# Altium schematic sheet 小车主板原理图.SchDoc
size A3
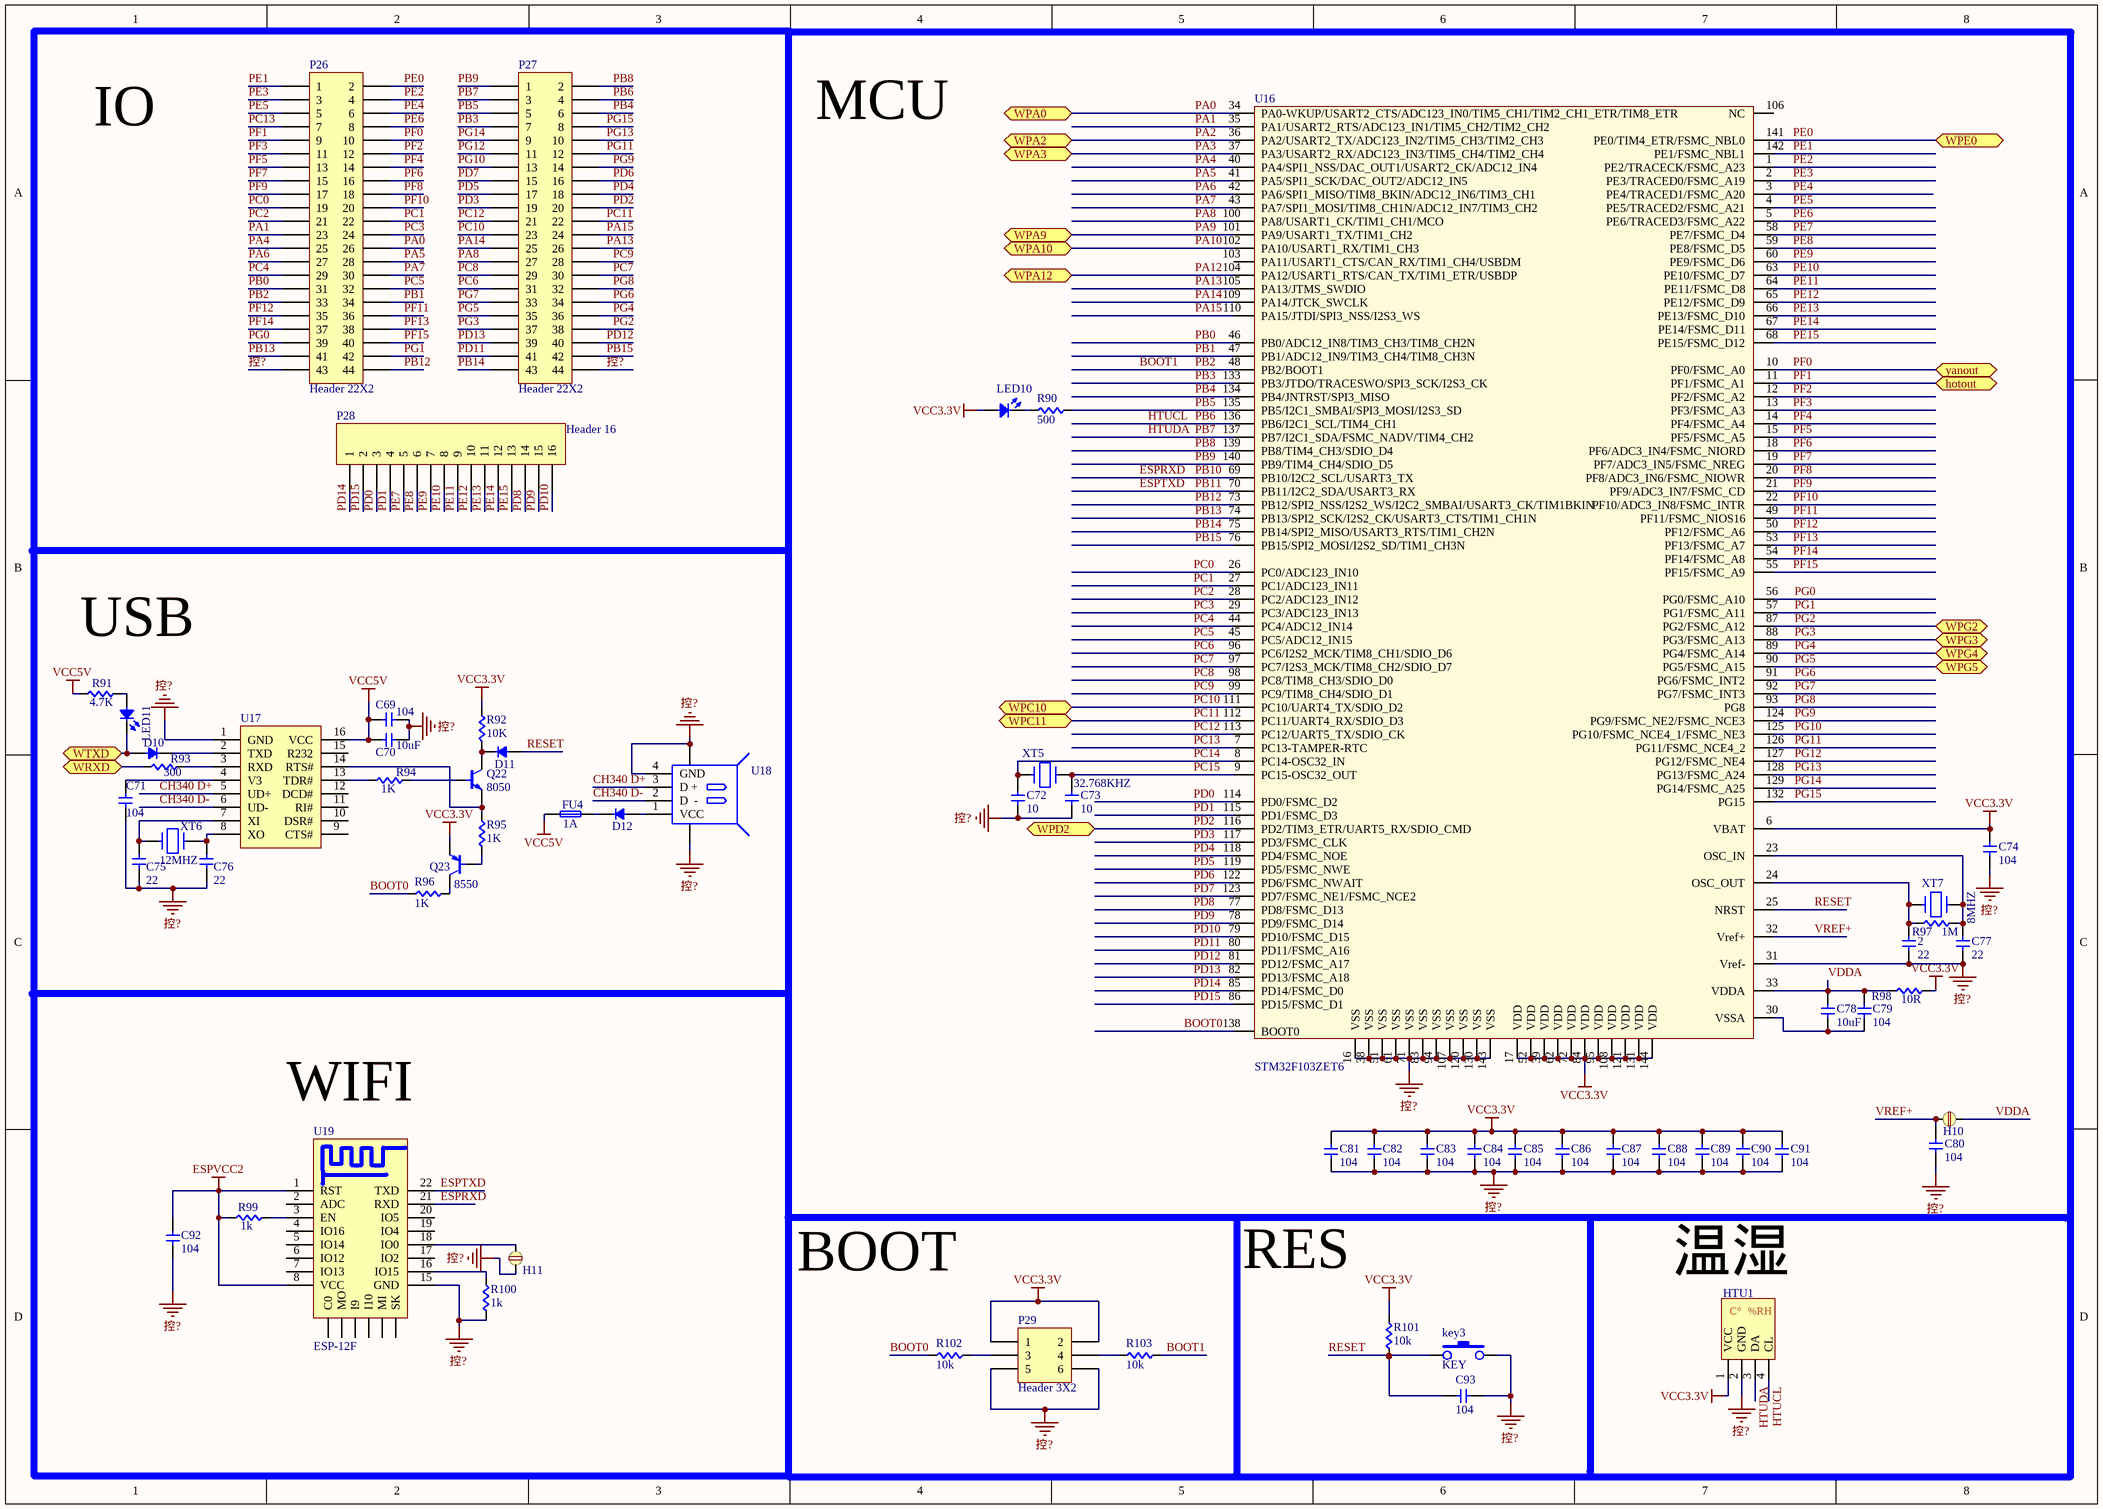
[diagram p0: 小车主板原理图.SchDoc]

## Parts
2  22  [0805C]
C69  104  [0805C]
C70  10uF  [0805C]
C71  104  [0805C]
C72  10  [0805C]
C73  10  [0805C]
C74  104  [0805C]
C75  22  [0805C]
C76  22  [0805C]
C77  22  [0805C]
C78  10uF  [0805C]
C79  104  [0805C]
C80  104  [0805C]
C81  104  [0805C]
C82  104  [0805C]
C83  104  [0805C]
C84  104  [0805C]
C85  104  [0805C]
C86  104  [0805C]
C87  104  [0805C]
C88  104  [0805C]
C89  104  [0805C]
C90  104  [0805C]
C91  104  [0805C]
C92  104  [0805C]
C93  104  [0805C]
D10  D  [1206D]  (value not drawn)
D11  D  [1206D]  (value not drawn)
D12  D  [DO-214-M7-  4007贴片]  (value not drawn)
FU4  1A  [1206]
H10  2脚  [2P]  (value not drawn)
H11  2脚  [2P]  (value not drawn)
HTU1  HTU21D  [HDR1X4H]  (value not drawn)
key3  KEY  [AN12]
LED10  LED  [0805D]  (value not drawn)
LED11  LED  [0805D]  (value not drawn)
P26  Header 22X2  [HDR2X22]
P27  Header 22X2  [HDR2X22]
P28  Header 16  [HDR1X16]
P29  Header 3X2  [HDR2X3]
Q22  8050  [SOT-23]
Q23  8550  [SOT-23]
R90  500  [0805]
R91  4.7K  [0805]
R92  10K  [0805]
R93  300  [0805]
R94  1K  [0805]
R95  1K  [0805]
R96  1K  [0805]
R97  1M  [0805]
R98  10R  [0805]
R99  1k  [0805]
R100  1k  [0805]
R101  10k  [0805]
R102  10k  [0805]
R103  10k  [0805]
U16  STM32F103ZET6  [TQFP144]
U17  CH340G  [SOP-16]  (value not drawn)
U18  USB A  [USB A 公]  (value not drawn)
U19  ESP-12F  [ESP-12F]
XT5  32.768KHZ  [XTAL-T]
XT6  12MHZ  [XTAL-T]
XT7  8MHZ  [XTAL-T]

## Ports
hotout, WPA0, WPA2, WPA3, WPA9, WPA10, WPA12, WPC10, WPC11, WPD2, WPE0, WPG2, WPG3, WPG4, WPG5, WRXD, WTXD, yanout

## Nets
ESPVCC2: C92.2 R99.1 U19.1(RST) U19.8(VCC)
VCC3.3V: C74.1 C81.2 C82.2 C83.2 C84.2 C85.2 C86.2 C87.2 C88.2 C89.2 C90.2 C91.2 HTU1.1(VCC) LED10.1(A) P29.1 P29.2 Q23.2(e) R92.2 R98.2 R101.2 U16.6(VBAT) U16.17(VDD) U16.39(VDD) U16.52(VDD) U16.62(VDD) U16.72(VDD) U16.84(VDD) U16.95(VDD) U16.108(VDD) U16.121(VDD) U16.131(VDD) U16.144(VDD)
VCC5V: C69.1 C70.1 FU4.1 R91.2 U17.16(VCC)
控?: 2.1 C69.2 C70.2 C71.2 C72.1 C73.1 C74.2 C75.1 C76.1 C77.1 C80.1 C81.1 C82.1 C83.1 C84.1 C85.1 C86.1 C87.1 C88.1 C89.1 C90.1 C91.1 C92.1 C93.2 H11.1 HTU1.2(GND) key3.2 P26.43 P27.44 P29.5 P29.6 R100.1 U16.16(VSS) U16.31(Vref-) U16.38(VSS) U16.51(VSS) U16.61(VSS) U16.71(VSS) U16.83(VSS) U16.94(VSS) U16.107(VSS) U16.120(VSS) U16.130(VSS) U16.143(VSS) U17.1(GND) U18.4(GND) U18.5 U18.6 U19.15(GND)
BOOT0: R96.1 R102.2 U16.138(BOOT0)
BOOT1: P26.33 R103.1 U16.48(PB2/BOOT1)  [also labelled PB2]
CH340 D+: U17.5(UD+) U18.3(D_+)
CH340 D-: U17.6(UD-) U18.2(D__-)
ESPRXD: U16.69(PB10/I2C2_SCL/USART3_TX) U19.21(RXD)  [also labelled PB10]
ESPTXD: U16.70(PB11/I2C2_SDA/USART3_RX) U19.22(TXD)  [also labelled PB11]
HTUCL: HTU1.4(CL) P27.4 U16.136(PB6/I2C1_SCL/TIM4_CH1)  [also labelled PB6]
HTUDA: HTU1.3(DA) P27.3 U16.137(PB7/I2C1_SDA/FSMC_NADV/TIM4_CH2)  [also labelled PB7]
PA0: P26.26 U16.34(PA0-WKUP/USART2_CTS/ADC123_IN0/TIM5_CH1/TIM2_CH1_ETR/TIM8_ETR) ; port WPA0
PA1: P26.23 U16.35(PA1/USART2_RTS/ADC123_IN1/TIM5_CH2/TIM2_CH2)
PA2: U16.36(PA2/USART2_TX/ADC123_IN2/TIM5_CH3/TIM2_CH3) ; port WPA2
PA3: U16.37(PA3/USART2_RX/ADC123_IN3/TIM5_CH4/TIM2_CH4) ; port WPA3
PA4: P26.25 U16.40(PA4/SPI1_NSS/DAC_OUT1/USART2_CK/ADC12_IN4)
PA5: P26.28 U16.41(PA5/SPI1_SCK/DAC_OUT2/ADC12_IN5)
PA6: P26.27 U16.42(PA6/SPI1_MISO/TIM8_BKIN/ADC12_IN6/TIM3_CH1)
PA7: P26.30 U16.43(PA7/SPI1_MOSI/TIM8_CH1N/ADC12_IN7/TIM3_CH2)
PA8: P27.27 U16.100(PA8/USART1_CK/TIM1_CH1/MCO)
PA9: U16.101(PA9/USART1_TX/TIM1_CH2) ; port WPA9
PA10: U16.102(PA10/USART1_RX/TIM1_CH3) ; port WPA10
PA12: U16.104(PA12/USART1_RTS/CAN_TX/TIM1_ETR/USBDP) ; port WPA12
PA13: P27.26 U16.105(PA13/JTMS_SWDIO)
PA14: P27.25 U16.109(PA14/JTCK_SWCLK)
PA15: P27.24 U16.110(PA15/JTDI/SPI3_NSS/I2S3_WS)
PB0: P26.31 U16.46(PB0/ADC12_IN8/TIM3_CH3/TIM8_CH2N)
PB1: P26.34 U16.47(PB1/ADC12_IN9/TIM3_CH4/TIM8_CH3N)
PB3: P27.7 U16.133(PB3/JTDO/TRACESWO/SPI3_SCK/I2S3_CK)
PB4: P27.6 U16.134(PB4/JNTRST/SPI3_MISO)
PB5: P27.5 R90.2 U16.135(PB5/I2C1_SMBAI/SPI3_MOSI/I2S3_SD)
PB8: P27.2 U16.139(PB8/TIM4_CH3/SDIO_D4)
PB9: P27.1 U16.140(PB9/TIM4_CH4/SDIO_D5)
PB12: P26.44 U16.73(PB12/SPI2_NSS/I2S2_WS/I2C2_SMBAI/USART3_CK/TIM1BKIN)
PB13: P26.41 U16.74(PB13/SPI2_SCK/I2S2_CK/USART3_CTS/TIM1_CH1N)
PB14: P27.43 U16.75(PB14/SPI2_MISO/USART3_RTS/TIM1_CH2N)
PB15: P27.42 U16.76(PB15/SPI2_MOSI/I2S2_SD/TIM1_CH3N)
PC0: P26.19 U16.26(PC0/ADC123_IN10)
PC1: P26.22 U16.27(PC1/ADC123_IN11)
PC2: P26.21 U16.28(PC2/ADC123_IN12)
PC3: P26.24 U16.29(PC3/ADC123_IN13)
PC4: P26.29 U16.44(PC4/ADC12_IN14)
PC5: P26.32 U16.45(PC5/ADC12_IN15)
PC6: P27.31 U16.96(PC6/I2S2_MCK/TIM8_CH1/SDIO_D6)
PC7: P27.30 U16.97(PC7/I2S3_MCK/TIM8_CH2/SDIO_D7)
PC8: P27.29 U16.98(PC8/TIM8_CH3/SDIO_D0)
PC9: P27.28 U16.99(PC9/TIM8_CH4/SDIO_D1)
PC10: P27.23 U16.111(PC10/UART4_TX/SDIO_D2) ; port WPC10
PC11: P27.22 U16.112(PC11/UART4_RX/SDIO_D3) ; port WPC11
PC12: P27.21 U16.113(PC12/UART5_TX/SDIO_CK)
PC13: P26.7 U16.7(PC13-TAMPER-RTC)
PC14: C72.2 U16.8(PC14-OSC32_IN) XT5.1
PC15: C73.2 U16.9(PC15-OSC32_OUT) XT5.2
PD0: P28.3 U16.114(PD0/FSMC_D2)
PD1: P28.4 U16.115(PD1/FSMC_D3)
PD2: P27.20 U16.116(PD2/TIM3_ETR/UART5_RX/SDIO_CMD) ; port WPD2
PD3: P27.19 U16.117(PD3/FSMC_CLK)
PD4: P27.18 U16.118(PD4/FSMC_NOE)
PD5: P27.17 U16.119(PD5/FSMC_NWE)
PD6: P27.16 U16.122(PD6/FSMC_NWAIT)
PD7: P27.15 U16.123(PD7/FSMC_NE1/FSMC_NCE2)
PD8: P28.14 U16.77(PD8/FSMC_D13)
PD9: P28.15 U16.78(PD9/FSMC_D14)
PD10: P28.16 U16.79(PD10/FSMC_D15)
PD11: P27.41 U16.80(PD11/FSMC_A16)
PD12: P27.40 U16.81(PD12/FSMC_A17)
PD13: P27.39 U16.82(PD13/FSMC_A18)
PD14: P28.1 U16.85(PD14/FSMC_D0)
PD15: P28.2 U16.86(PD15/FSMC_D1)
PE0: P26.2 U16.141(PE0/TIM4_ETR/FSMC_NBL0) ; port WPE0
PE1: P26.1 U16.142(PE1/FSMC_NBL1)
PE2: P26.4 U16.1(PE2/TRACECK/FSMC_A23)
PE3: P26.3 U16.2(PE3/TRACED0/FSMC_A19)
PE4: P26.6 U16.3(PE4/TRACED1/FSMC_A20)
PE5: P26.5 U16.4(PE5/TRACED2/FSMC_A21)
PE6: P26.8 U16.5(PE6/TRACED3/FSMC_A22)
PE7: P28.5 U16.58(PE7/FSMC_D4)
PE8: P28.6 U16.59(PE8/FSMC_D5)
PE9: P28.7 U16.60(PE9/FSMC_D6)
PE10: P28.8 U16.63(PE10/FSMC_D7)
PE11: P28.9 U16.64(PE11/FSMC_D8)
PE12: P28.10 U16.65(PE12/FSMC_D9)
PE13: P28.11 U16.66(PE13/FSMC_D10)
PE14: P28.12 U16.67(PE14/FSMC_D11)
PE15: P28.13 U16.68(PE15/FSMC_D12)
PF0: P26.10 U16.10(PF0/FSMC_A0) ; port yanout
PF1: P26.9 U16.11(PF1/FSMC_A1) ; port hotout
PF2: P26.12 U16.12(PF2/FSMC_A2)
PF3: P26.11 U16.13(PF3/FSMC_A3)
PF4: P26.14 U16.14(PF4/FSMC_A4)
PF5: P26.13 U16.15(PF5/FSMC_A5)
PF6: P26.16 U16.18(PF6/ADC3_IN4/FSMC_NIORD)
PF7: P26.15 U16.19(PF7/ADC3_IN5/FSMC_NREG)
PF8: P26.18 U16.20(PF8/ADC3_IN6/FSMC_NIOWR)
PF9: P26.17 U16.21(PF9/ADC3_IN7/FSMC_CD)
PF10: P26.20 U16.22(PF10/ADC3_IN8/FSMC_INTR)
PF11: P26.36 U16.49(PF11/FSMC_NIOS16)
PF12: P26.35 U16.50(PF12/FSMC_A6)
PF13: P26.38 U16.53(PF13/FSMC_A7)
PF14: P26.37 U16.54(PF14/FSMC_A8)
PF15: P26.40 U16.55(PF15/FSMC_A9)
PG0: P26.39 U16.56(PG0/FSMC_A10)
PG1: P26.42 U16.57(PG1/FSMC_A11)
PG2: P27.38 U16.87(PG2/FSMC_A12) ; port WPG2
PG3: P27.37 U16.88(PG3/FSMC_A13) ; port WPG3
PG4: P27.36 U16.89(PG4/FSMC_A14) ; port WPG4
PG5: P27.35 U16.90(PG5/FSMC_A15) ; port WPG5
PG6: P27.34 U16.91(PG6/FSMC_INT2)
PG7: P27.33 U16.92(PG7/FSMC_INT3)
PG8: P27.32 U16.93(PG8)
PG9: P27.14 U16.124(PG9/FSMC_NE2/FSMC_NCE3)
PG10: P27.13 U16.125(PG10/FSMC_NCE4_1/FSMC_NE3)
PG11: P27.12 U16.126(PG11/FSMC_NCE4_2)
PG12: P27.11 U16.127(PG12/FSMC_NE4)
PG13: P27.10 U16.128(PG13/FSMC_A24)
PG14: P27.9 U16.129(PG14/FSMC_A25)
PG15: P27.8 U16.132(PG15)
RESET: C93.1 D11.1(A) key3.1 R101.1 U16.25(NRST)
VDDA: C78.2 C79.2 H10.2 R98.1 U16.33(VDDA)
VREF+: C80.2 H10.1 U16.32(Vref+)
WRXD: R93.1 ; port WRXD
WTXD: D10.1(A) LED11.2(K) ; port WTXD
Net2_2: 2.2 R97.1 U16.24(OSC_OUT) XT7.1
NetC71_1: C71.1 U17.4(V3)
NetC75_2: C75.2 U17.7(XI) XT6.1
NetC76_2: C76.2 U17.8(XO) XT6.2
NetC77_2: C77.2 R97.2 U16.23(OSC_IN) XT7.2
NetC78_1: C78.1 C79.1 U16.30(VSSA)
NetD10_2: D10.2(K) U17.2(TXD)
NetD11_2: D11.2(K) Q22.1(c) R92.1
NetD12_1: D12.1(A) U18.1(VCC)
NetD12_2: D12.2(K) FU4.2
NetH11_2: H11.2 U19.18(IO0)
NetLED10_2: LED10.2(K) R90.1
NetLED11_1: LED11.1(A) R91.1
NetP29_3: P29.3 R102.1
NetP29_4: P29.4 R103.2
NetQ22_2: Q22.2(e) R95.2 U17.14(RTS#)
NetQ22_3: Q22.3(b) R94.2
NetQ23_1: Q23.1(c) R96.2
NetQ23_3: Q23.3(b) R95.1
NetR93_2: R93.2 U17.3(RXD)
NetR94_1: R94.1 U17.13(TDR#)
NetR99_2: R99.2 U19.3(EN)
NetR100_2: R100.2 U19.16(IO15)

Not connected (* = marked no-connect by the designer): U16 103(PA11/USART1_CTS/CAN_RX/TIM1_CH4/USBDM) 106(NC); U17 9(CTS#) 10(DSR#) 11(RI#) 12(DCD#) 15(R232); U19 2(ADC) 4(IO16) 5(IO14) 6(IO12) 7(IO13) 9(C0) 10(MO) 11(I9) 12(I10) 13(MI) 14(SK) 17(IO2) 19(IO4) 20(IO5)

## Notes on the sheet
- IO
- MCU
- USB
- WIFI
- BOOT
- RES
- 温湿
- (in symbol HTU) C°  %RH

## Library data of the parts
2 C69-C93 = C
D10-D12 = D: Value: 4007; Published: 8-Jun-2000; LatestRevisionDate: 17-Jul-2002; LatestRevisionNote: Re-released for DXP Platform.; PackageVersion: Sep-1996; PackageReference: SMC; Publisher: Altium Limited; PackageDescription: DO-214-AB/SMC; 2 C-Bend Leads; Body 7.9 x 5.9 mm, inc. leads (LxW); Code_JEDEC: DO-214-AB
FU4 = F
HTU1 = HTU
P26 P27 = Header 22X2: Header, 22-Pin, Dual row; LatestRevisionDate: 17-Jul-2002; LatestRevisionNote: Re-released for DXP Platform.; Publisher: Altium Limited
P28 = Header 16: Header, 16-Pin; LatestRevisionDate: 17-Jul-2002; LatestRevisionNote: Re-released for DXP Platform.; Publisher: Altium Limited
P29 = Header 3X2: Header, 3-Pin, Dual row; LatestRevisionDate: 17-Jul-2002; LatestRevisionNote: Re-released for DXP Platform.; Publisher: Altium Limited
Q22 = NPN
Q23 = PNP
R90-R103 = Res
U16 = STM32F103Z
U17 = CH3
U18 = US
U19 = ESP-
XT5-XT7 = X
LED10 LED11 = LED: Published: 8-Jun-2000; LatestRevisionDate: 08-Jul-2005; LatestRevisionNote: Mech Layer 1 removed.; PackageReference: LED-0; Publisher: Altium Limited; PackageDescription: LED; 2 Leads